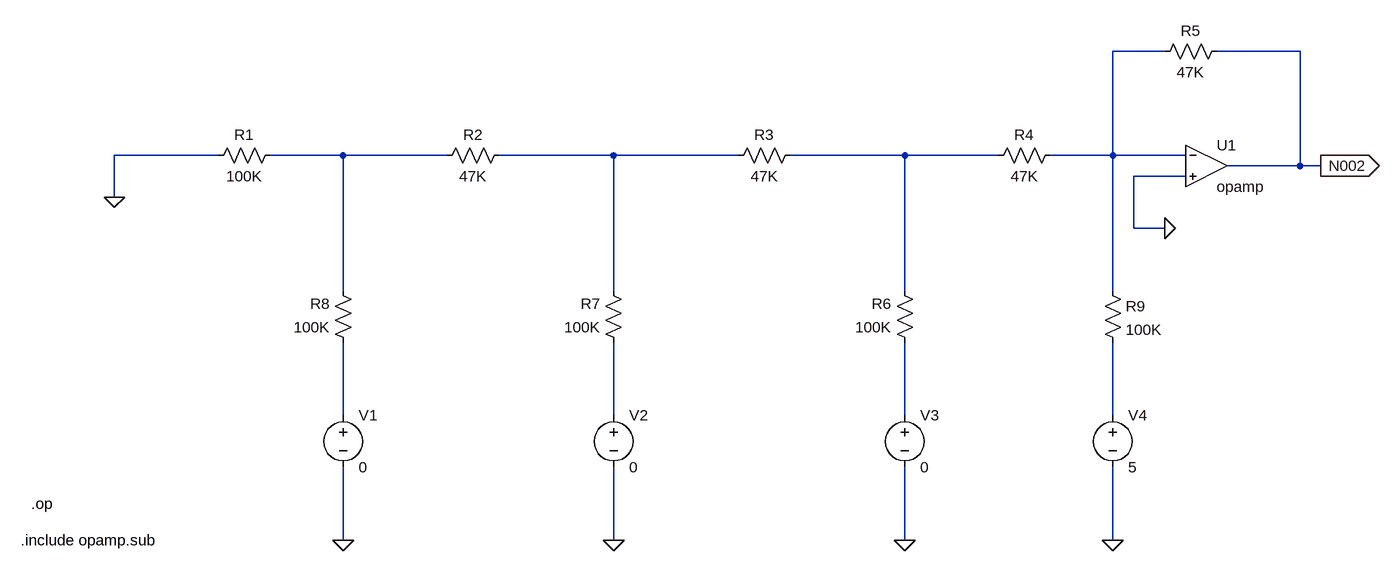
[diagram p0: schematic Cirvcuits Lab05.asc]
Cirvcuits Lab05.asc, the LTspice schematic file:
Version 4
SHEET 1 1708 768
WIRE 1360 0 1280 0
WIRE 1568 0 1440 0
WIRE -96 160 -256 160
WIRE 96 160 -16 160
WIRE 256 160 96 160
WIRE 512 160 336 160
WIRE 704 160 512 160
WIRE 960 160 784 160
WIRE 1104 160 960 160
WIRE 1280 160 1280 0
WIRE 1280 160 1184 160
WIRE 1392 160 1280 160
WIRE 1568 176 1568 0
WIRE 1568 176 1456 176
WIRE 1600 176 1568 176
WIRE 1392 192 1312 192
WIRE -256 224 -256 160
WIRE 1312 272 1312 192
WIRE 1360 272 1312 272
WIRE 96 368 96 160
WIRE 512 368 512 160
WIRE 960 368 960 160
WIRE 1280 368 1280 160
WIRE 96 560 96 448
WIRE 512 560 512 448
WIRE 960 560 960 448
WIRE 1280 560 1280 448
WIRE 96 752 96 640
WIRE 512 752 512 640
WIRE 960 752 960 640
WIRE 1280 752 1280 640
FLAG -256 224 0
FLAG 1360 272 0
FLAG 96 752 0
FLAG 512 752 0
FLAG 960 752 0
FLAG 1280 752 0
FLAG 1600 176 N002
IOPIN 1600 176 Out
SYMBOL res 0 144 R90
WINDOW 0 0 56 VBottom 2
WINDOW 3 32 56 VTop 2
SYMATTR InstName R1
SYMATTR Value 100K
SYMBOL res 352 144 R90
WINDOW 0 0 56 VBottom 2
WINDOW 3 32 56 VTop 2
SYMATTR InstName R2
SYMATTR Value 47K
SYMBOL res 800 144 R90
WINDOW 0 0 56 VBottom 2
WINDOW 3 32 56 VTop 2
SYMATTR InstName R3
SYMATTR Value 47K
SYMBOL res 1200 144 R90
WINDOW 0 0 56 VBottom 2
WINDOW 3 32 56 VTop 2
SYMATTR InstName R4
SYMATTR Value 47K
SYMBOL res 1456 -16 R90
WINDOW 0 0 56 VBottom 2
WINDOW 3 32 56 VTop 2
SYMATTR InstName R5
SYMATTR Value 47K
SYMBOL res 976 464 R180
WINDOW 0 36 76 Left 2
WINDOW 3 36 40 Left 2
SYMATTR InstName R6
SYMATTR Value 100K
SYMBOL res 528 464 R180
WINDOW 0 36 76 Left 2
WINDOW 3 36 40 Left 2
SYMATTR InstName R7
SYMATTR Value 100K
SYMBOL res 112 464 R180
WINDOW 0 36 76 Left 2
WINDOW 3 36 40 Left 2
SYMATTR InstName R8
SYMATTR Value 100K
SYMBOL OpAmps/opamp 1424 112 R0
SYMATTR InstName U1
SYMBOL res 1264 352 R0
SYMATTR InstName R9
SYMATTR Value 100K
SYMBOL voltage 96 544 R0
SYMATTR InstName V1
SYMATTR Value 0
SYMBOL voltage 512 544 R0
SYMATTR InstName V2
SYMATTR Value 0
SYMBOL voltage 960 544 R0
SYMATTR InstName V3
SYMATTR Value 0
SYMBOL voltage 1280 544 R0
SYMATTR InstName V4
SYMATTR Value 5
TEXT -400 752 Left 2 !.include opamp.sub
TEXT -384 696 Left 2 !.op

The netlist it stands for:
* Cirvcuits Lab05.asc
R1 N003 0 100K
R2 N004 N003 47K
R3 N005 N004 47K
R4 N001 N005 47K
R5 N002 N001 47K
R6 N008 N005 100K
R7 N007 N004 100K
R8 N006 N003 100K
XU1 N001 0 N002 opamp Aol=100K GBW=10Meg  ; pins invin noninvin out
R9 N001 N009 100K
V1 N006 0 0
V2 N007 0 0
V3 N008 0 0
V4 N009 0 5
.include opamp.sub
.op
.backanno
.end